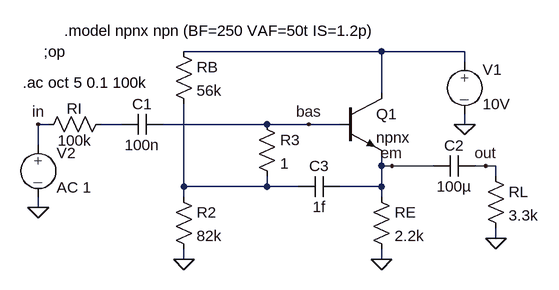
[diagram p0: schematic e-folger-bootstrap.asc]
e-folger-bootstrap.asc, the LTspice schematic file:
Version 4
SHEET 1 880 680
WIRE 400 48 96 48
WIRE 528 48 400 48
WIRE 528 64 528 48
WIRE 400 112 400 48
WIRE -112 160 -128 160
WIRE 0 160 -32 160
WIRE 224 160 64 160
WIRE 288 160 224 160
WIRE 336 160 288 160
WIRE 528 160 528 144
WIRE -128 192 -128 160
WIRE 400 224 400 208
WIRE 416 224 400 224
WIRE 480 224 416 224
WIRE 560 224 544 224
WIRE 576 224 560 224
WIRE 576 240 576 224
WIRE 96 256 96 128
WIRE 224 256 224 240
WIRE 224 256 96 256
WIRE 272 256 224 256
WIRE 400 256 400 224
WIRE 400 256 336 256
WIRE 96 272 96 256
WIRE 400 272 400 256
WIRE -128 288 -128 272
WIRE 576 336 576 320
WIRE 96 368 96 352
WIRE 400 368 400 352
FLAG 528 160 0
FLAG 400 368 0
FLAG 576 336 0
FLAG -128 288 0
FLAG 560 224 out
FLAG 416 224 em
FLAG 288 160 bas
FLAG -128 160 in
FLAG 96 368 0
SYMBOL EIT_Semiconductors\\npn 336 112 R0
SYMATTR InstName Q1
SYMATTR Value npnx
SYMBOL source-V 528 48 R0
SYMATTR InstName V1
SYMATTR Value 10V
SYMBOL res 80 32 R0
SYMATTR InstName RB
SYMATTR Value 56k
SYMBOL res 560 224 R0
SYMATTR InstName RL
SYMATTR Value 3.3k
SYMBOL cap 480 240 R270
WINDOW 0 32 32 VTop 2
WINDOW 3 0 32 VBottom 2
SYMATTR InstName C2
SYMATTR Value 100µ
SYMBOL cap 0 176 R270
WINDOW 0 32 32 VTop 2
WINDOW 3 0 32 VBottom 2
SYMATTR InstName C1
SYMATTR Value 100n
SYMBOL res -128 176 R270
WINDOW 0 25 56 VTop 2
WINDOW 3 7 56 VBottom 2
SYMATTR InstName RI
SYMATTR Value 100k
SYMBOL source-V -128 176 R0
SYMATTR InstName V2
SYMATTR Value AC 1
SYMBOL res 80 256 R0
SYMATTR InstName R2
SYMATTR Value 82k
SYMBOL res 384 256 R0
SYMATTR InstName RE
SYMATTR Value 2.2k
SYMBOL res 208 144 R0
SYMATTR InstName R3
SYMATTR Value 1
SYMBOL cap 272 272 R270
WINDOW 0 32 32 VTop 2
WINDOW 3 0 32 VBottom 2
SYMATTR InstName C3
SYMATTR Value 1f
TEXT -88 16 Left 2 !.model npnx npn (BF=250 VAF=50t IS=1.2p)
TEXT -120 48 Left 2 !;op
TEXT -152 96 Left 2 !.ac oct 5 0.1 100k

The netlist it stands for:
* e-folger-bootstrap.asc
Q1 N001 bas em 0 npnx
V1 N001 0 10V
RB N001 N003 56k
RL out 0 3.3k
C2 em out 100µ
C1 N002 bas 100n
RI in N002 100k
V2 in 0 AC 1
R2 N003 0 82k
RE em 0 2.2k
R3 bas N003 1
C3 N003 em 1f
.model NPN NPN
.model PNP PNP
.lib standard.bjt
.model npnx npn (BF=250 VAF=50t IS=1.2p)
;op
.ac oct 5 0.1 100k
.backanno
.end